# EAGLE design rx (EAGLE 9.1.3)
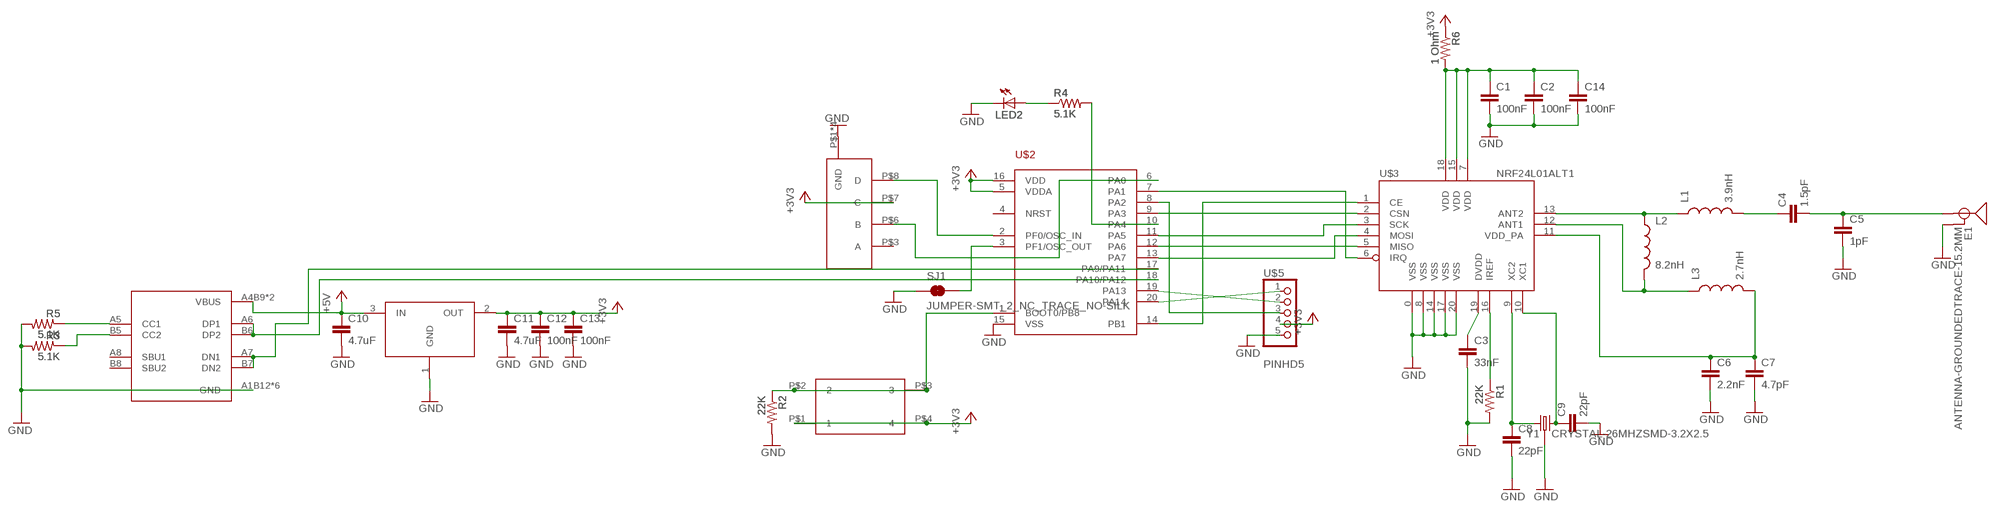
[diagram p0: schematic, sheet 1]

## Parts
C1  100nF  CAP0805  [0805]
C2  100nF  CAP0805  [0805]
C3  33nF  CAP0805  [0805]
C4  1.5pF  CAP0805  [0805]
C5  1pF  CAP0805  [0805]
C6  2.2nF  CAP0805  [0805]
C7  4.7pF  CAP0805  [0805]
C8  22pF  CAP0805  [0805]
C9  22pF  CAP0805  [0805]
C10  4.7uF  CAP0805  [0805]
C11  4.7uF  CAP0805  [0805]
C12  100nF  CAP0805  [0805]
C13  100nF  CAP0805  [0805]
C14  100nF  CAP0805  [0805]
E1  ANTENNA-GROUNDEDTRACE-15.2MM  [TRACE_ANTENNA_2.4GHZ_15.2MM]
L1  3.9nH  INDUCTOR0805  [0805]
L2  8.2nH  INDUCTOR0805  [0805]
L3  2.7nH  INDUCTOR0805  [0805]
LED2  LEDCHIP-LED0805  [CHIP-LED0805]
R1  22K  RESISTOR0805-RES  [0805]
R2  22K  RESISTOR0805-RES  [0805]
R3  5.1K  RESISTOR0805-RES  [0805]
R4  5.1K  RESISTOR0805-RES  [0805]
R5  5.1K  RESISTOR0805-RES  [0805]
R6  1 Ohm  RESISTOR0805-RES  [0805]
SJ1  JUMPER-SMT_2_NC_TRACE_NO-SILK  [SMT-JUMPER_2_NC_TRACE_NO-SILK]
U$1  SW_3POS_DEVSW_3POS_OFFICIAL  [SW_3POS_FOOT_OFFICIAL]
U$2  STM32F042F4  [TSSOP20]
U$3  NRF24L01ALT1  [QFN20_ALT1]
U$4  XC6206_DEV  [SOT23R_INFINEON]
U$5  PINHD5  [1X05]
U$6  USBC_16P  [USBC_16P_FOOT]
U$10  324_SW324_SWITCH_FOOT_HOLE  [342_SWICH_FOOT_HOLE]
Y1  CRYSTAL-26MHZSMD-3.2X2.5  [CRYSTAL-SMD-3.2X2.5MM]

## Nets
+3V3: C11.1 C12.1 C13.1 R6.1 U$1.P$7(C) U$2.5(VDDA) U$2.16(VDD) U$4.2(OUT) U$5.4 U$10.P$1 U$10.P$4
+5V: C10.1 U$4.3(IN) U$6.A4B9(VBUS) U$6.B4A9(VBUS)
GND: C1.2 C2.2 C3.2 C5.2 C6.2 C7.2 C8.2 C9.2 C10.2 C11.2 C12.2 C13.2 C14.2 E1.GND LED2.C R1.2 R2.2 R3.2 R5.2 SJ1.1 U$1.P$1(GND) U$1.P$2(GND) U$1.P$4(GND) U$1.P$5(GND) U$2.15(VSS) U$3.0(VSS) U$3.8(VSS) U$3.14(VSS) U$3.17(VSS) U$3.20(VSS) U$4.1(GND) U$5.5 U$6.A1B12(GND) U$6.B11A12(GND) U$6.P$13(GND) U$6.P$14(GND) U$6.P$15(GND) U$6.P$16(GND) Y1.2 Y1.4
N$1: C3.1 U$3.19(DVDD)
N$2: R1.1 U$3.16(IREF)
N$3: L1.1 L2.1 U$3.13(ANT2)
N$4: C4.1 L1.2
N$5: C4.2 C5.1 E1.ANT(SIGNAL)
N$6: L2.2 L3.1 U$3.12(ANT1)
N$7: C8.1 U$3.9(XC2) Y1.1
N$8: C6.1 C7.1 L3.2 U$3.11(VDD_PA)
N$9: C9.1 U$3.10(XC1) Y1.3
N$10: U$1.P$8(D) U$2.2(PF0/OSC_IN)
N$11: R2.1 U$2.1(BOOT0/PB8) U$10.P$2 U$10.P$3
N$12: U$2.17(PA9/PA11) U$6.A7(DN1) U$6.B7(DN2)
N$13: U$2.18(PA10/PA12) U$6.A6(DP1) U$6.B6(DP2)
N$14: U$2.12(PA6) U$3.5(MISO)
N$15: U$2.13(PA7) U$3.4(MOSI)
N$16: U$2.11(PA5) U$3.3(SCK)
N$17: U$2.19(PA13) U$5.2
N$18: LED2.A R4.1
N$19: SJ1.2 U$2.3(PF1/OSC_OUT)
N$20: U$2.20(PA14) U$5.1
N$21: U$2.8(PA2) U$5.3
N$22: U$2.14(PB1) U$3.1(CE)
N$23: R4.2 U$2.10(PA4)
N$24: U$2.9(PA3) U$3.2(CSN)
N$25: R3.1 U$6.B5(CC2)
N$26: U$1.P$6(B) U$2.6(PA0)
N$27: R5.1 U$6.A5(CC1)
N$28: C1.1 C2.1 C14.1 R6.2 U$3.7(VDD) U$3.15(VDD) U$3.18(VDD)
N$30: U$2.7(PA1) U$3.6(IRQ)
Unconnected: U$1.P$3(A) U$2.4(NRST) U$6.A8(SBU1) U$6.B8(SBU2)

## Library data of the parts
C1-C14 = clock:CAP: Capacitor Standard 0603 ceramic capacitor, and 0.1" leaded capacitor.
E1 = SparkFun-RF:ANTENNA-GROUNDED: Antenna w/ Ground Connection 2.4GHz antennae with signal and ground terminals. TRACE_ANTENNA_2.4GHZ_15.2MM - Meander Trace antenna 15.2 x 5.7mm footprint Based on layout from TI app note AN043 <http://www.ti.com/lit/an/swra117d/swra117d.pdf>. TRACE_ANTENNA_2.4GHZ_25.7MM - Inverted F trace antenna 25.7 x 7.5 mm footprint. Based on layout from TI design note DN0007 <http://www.ti.com/lit/an/swru120b/swru120b.pdf>.
L1-L3 = basicBoard:INDUCTOR: Inductors Basic Inductor/Choke - 0603 and 1206. Footprints are not proven and vary greatly between part numbers. INDUCTOR POWER 3.3UH 4.0A SMD 0.197" L x 0.197" W x 0.177" H (5.00mm x 5.00mm x 4.50mm)
LED2 = joyAnalog:LED: LED OSRAM: - CHIPLED LG R971, LG N971, LY N971, LG Q971, LY Q971, LO R971, LY R971 LH N974, LH R974 LS Q976, LO Q976, LY Q976 LO Q996 - Hyper CHIPLED LW Q18S LB Q993, LB Q99A, LB R99A - SideLED LS A670, LO A670, LY A670, LG A670, LP A670 LB A673, LV A673, LT A673, LW A673 LH A674 LY A675 LS A676, LA A676, LO A676, LY A676, LW A676 LS A679, LY A679, LG A679 - Hyper Micro SIDELED® LS Y876, LA Y876, LO Y876, LY Y876 LT Y87S - SmartLED LW L88C, LW L88S LB L89C, LB L89S, LG L890 LS L89K, LO L89K, LY L89K LS L896, LA L896, LO L896, LY L896 - TOPLED LS T670, LO T670, LY T670, LG T670, LP T670 LSG T670, LSP T670, LSY T670, LOP T670, LYG T670 LG T671, LOG T671, LSG T671 LB T673, LV T673, LT T673, LW T673 LH T674 LS T676, LA T676, LO T676, LY T676, LB T676, LH T676, LSB T676, LW T676 LB T67C, LV T67C, LT T67C, LS T67K, LO T67K, LY T67K, LW E67C LS E67B, LA E67B, LO E67B, LY E67B, LB E67C, LV E67C, LT E67C LW T67C LS T679, LY T679, LG T679 LS T770, LO T770, LY T770, LG T770, LP T770 LB T773, LV T773, LT T773, LW T773 LH T774 LS E675, LA E675, LY E675, LS T675 LS T776, LA T776, LO T776, LY T776, LB T776 LHGB T686 LT T68C, LB T68C - Hyper Mini TOPLED® LB M676 - Mini TOPLED Santana® LG M470 LS M47K, LO M47K, LY M47K Source: http://www.osram.convergy.de/
R1-R6 = joyAnalog:RESISTOR: Resistor Basic schematic elements and footprints for 0603, 1206, and PTH resistors.
SJ1 = SparkFun-Jumpers:JUMPER-SMT_2_NC_TRACE: Normally closed trace jumper This jumper has a trace between two pads so it's normally closed (NC). Use a razor knife to open the connection. For best results follow the IPC guidelines for cutting traces: Cutout at least 0.063 mm (0.005 in). Remove all loose material to clean up the cut area. Seal the cut with an approved epoxy. Reapply solder to reclose the connection.
U$1 = 3pos_slide_switch:SW_3POS_DEV
U$2 = tx:STM32F042F4
U$3 = nRF24L01-Chip-v13:NRF24L01: 2.4GHz Low Power Transceiver This is the very popular, low cost, very low power RF transceiver from Nordic Semiconductor. Simple SPI interface. SKU: COM-00690
U$4 = 3pos_slide_switch:XC6206_DEV
U$5 = adafruit_changed:PINHD5
U$6 = my_usbc_16p:USBC_16P
U$10 = 3pos_slide_switch:324_SW
Y1 = SparkFun-Clocks:CRYSTAL-26MHZ: 26MHz Crystal w/ Ground Pin Digikey Example <http://www.digikey.com/product-detail/en/epson/TSX-3225%2026.0000MF09Z-AC3/SER3627CT-ND/1802878> Frequency: 26MHz Frequency Stability: ±9ppm Frequency Tolerance: ±10ppm Load Capacitance: 9pF SparkFun Products: SparkFun ESP32 Thing <https://www.sparkfun.com/products/13907> SparkFun ESP8266 Thing Dev Board <https://www.sparkfun.com/products/13711>; PROD_ID: XTAL-12454

## Board
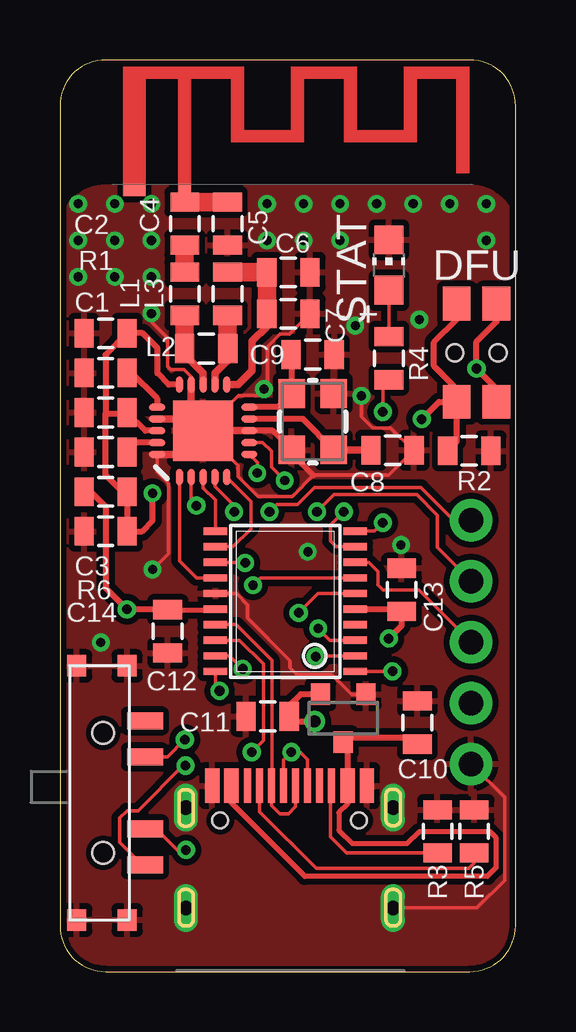
[diagram p1: board, top side]
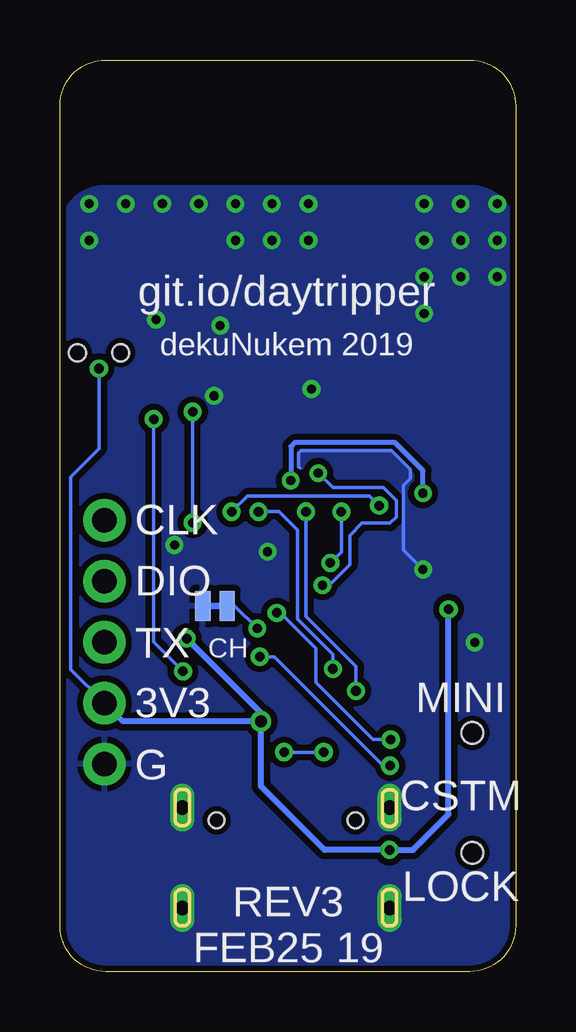
[diagram p2: board, bottom side, seen from below]

Size 19 x 38 mm. Coordinates in mm from the lower left corner, seen from the top.
Outline: 0,36.09 0,1.91 arc90 1.91,0 17.09,0 arc90 19,1.91 19,36.09 arc90 17.09,38 1.91,38 arc90 0,36.09
Copper layers (1*16): Top 0.035mm / dielectric 1.5mm / Bottom 0.035mm
Design rules "SparkFun-2-layer-TIGHT *": minimum track width 6mil, minimum drill 15mil, track to track 6mil, track to pad 6mil, pad to pad 6mil, via to via 6mil, smd to smd 6mil, copper to edge 8mil, drill to drill 6mil, minimum pad ring 7mil, minimum via ring 7mil, stop-mask expansion 4mil, vias tented up to drill 25mil, thermal gap 10mil

### Footprints (pad centres in the part's own frame; a part is rotated, then mirrored left to right if it is on the bottom)
0805 = smd 0.8 x 1.2: 1 -0.9,0; 2 0.9,0
TRACE_ANTENNA_2.4GHZ_15.2MM = smd 0.5 x 0.5: ANT 0,-0.25 | smd 0.9 x 0.5: GND -2.1,-0.25
CHIP-LED0805 = smd 1.2 x 1.2: A 0,-1.05; C 0,1.05
SMT-JUMPER_2_NC_TRACE_NO-SILK = smd 0.635 x 1.27: 1 -0.508,0; 2 0.508,0
SW_3POS_FOOT_OFFICIAL = smd 0.9 x 0.8: P$1 0,0; P$2 0,2.1; P$4 10.6,2.1; P$5 10.6,0 | smd 0.7 x 1.5: P$3 2.3,2.85; P$6 3.8,2.85; P$7 6.8,2.85; P$8 8.3,2.85 | hole 0.9: 2.8,1.1; 7.8,1.1
TSSOP20 = smd 0.305 x 0.991: 1 -2.925,-2.918; 2 -2.275,-2.918; 3 -1.625,-2.918; 4 -0.975,-2.918; 5 -0.325,-2.918; 6 0.325,-2.918; 7 0.975,-2.918; 8 1.625,-2.918; 9 2.275,-2.918; 10 2.925,-2.918; 11 2.925,2.918; 12 2.275,2.918; 13 1.625,2.918; 14 0.975,2.918; 15 0.325,2.918; 16 -0.325,2.918; 17 -0.975,2.918; 18 -1.625,2.918; 19 -2.275,2.918; 20 -2.925,2.918
QFN20_ALT1 = smd 2.515 x 2.515: 0 0,0 | smd 0.686 x 0.293: 1 -1.925,0.986; 2 -1.925,0.493; 3 -1.925,0; 4 -1.925,-0.493; 5 -1.925,-0.986; 11 1.925,-0.986; 12 1.925,-0.493; 13 1.925,0; 14 1.925,0.493; 15 1.925,0.986 | smd 0.293 x 0.686: 6 -0.986,-1.925; 7 -0.493,-1.925; 8 0,-1.925; 9 0.493,-1.925; 10 0.986,-1.925; 16 0.986,1.925; 17 0.493,1.925; 18 0,1.925; 19 -0.493,1.925; 20 -0.986,1.925
SOT23R_INFINEON = smd 0.8 x 0.9: 1 -0.95,-1; 2 0.95,-1; 3 0,1
1X05 = drill 1.016 pad 1.778: 1 -6.35,0; 2 -3.81,0; 3 -1.27,0; 4 1.27,0; 5 3.81,0
USBC_16P_FOOT = smd 0.6 x 1.45: A1B12 0,0; A4B9 0.8,0; B4A9 5.65,0; B11A12 6.45,0 | smd 0.3 x 1.45: A5 1.975,0; A6 2.975,0; A7 3.475,0; A8 4.475,0; B5 4.975,0; B6 3.975,0; B7 2.475,0; B8 1.475,0 | drill 0.6 pad 1 long: P$13 -1.095,-0.915; P$14 7.545,-0.915; P$15 -1.095,-5.095; P$16 7.545,-5.095 | hole 0.65: 0.335,-1.445; 6.115,-1.445
342_SWICH_FOOT_HOLE = smd 1.4 x 1.15: P$1 -2.05,-0.825; P$2 -2.05,0.825; P$3 2.05,0.825; P$4 2.05,-0.825 | hole 0.7: 0,0.9; 0,-0.9
CRYSTAL-SMD-3.2X2.5MM = smd 1.2 x 1.1: 1 -1.175,-0.875; 2 1.175,-0.875; 3 1.175,0.875; 4 -1.175,0.875

### Placement (x,y rotation side)
C1  1.91,23.3 180 top
C2  1.91,26.61 180 top
C3  1.91,21.65 180 top
C4  5.21,31.18 90 top
C5  6.99,31.18 270 top
C6  9.53,29.15 0 top
C7  9.53,27.42 0 top
C8  13.87,21.73 0 top
C9  10.54,25.72 0 top
C10  14.91,10.38 90 top
C11  8.66,10.63 180 top
C12  4.5,14.18 270 top
C13  14.25,15.92 90 top
C14  1.91,18.35 180 top
E1  5.21,32.82 0 top
L1  5.21,28.26 90 top
L2  6.1,25.97 0 top
L3  6.99,28.26 90 top
LED2  13.72,29.45 0 top
R1  1.91,24.96 180 top
R2  17.07,21.7 0 top
R3  15.75,5.84 90 top
R4  13.72,25.57 270 top
R5  17.27,5.84 90 top
R6  1.91,20 0 top
SJ1  12.54,15.24 0 bottom
U$1  0.7,12.75 270 top
U$2  9.4,15.43 90 top
U$3  5.97,22.54 90 top
U$4  11.81,10.56 180 top
U$5  17.14,12.46 270 top
U$6  6.35,7.75 0 top
U$10  17.37,25.79 90 top
Y1  10.54,22.92 90 top

### Tracks (layer width: path | path; a pad name or v marks a point on that pad's centre or on a via)
+3V3  (via drill 0.4, 0.5)
  Top 0.152: v5.26,5.07 4.89,5.07 4.01,5.95 U$1.P$7
  Top 0.203: 4.48,15.1 C12.1 6.45,15.08 U$2.16
  Top 0.254: U$2.5 14.16,15.11 C13.1 14.25,14.41 v13.72,13.88 | U$4.2 10.03,11.56 9.56,11.09 C11.1 9.77,10.43 v10.62,10.43 | U$10.P$1 18.2,24.31 v17.37,25.13 17.37,26.26 18.2,27.09 U$10.P$4 | R6.1 1.28,20 1.91,19.38 1.91,15.99 v2.79,15.1 4.48,15.1
  Bottom 0.152: U$5.4 18.54,12.59 18.54,20.62 17.37,21.79 v17.37,25.13
  Bottom 0.254: v10.62,10.43 10.62,7.72 7.96,5.07 v5.26,5.07 4.28,5.07 2.79,6.55 v2.79,15.1 | v10.62,10.43 16.38,10.43 U$5.4 | v13.72,13.88 10.62,10.78 v10.62,10.43
+5V
  Top 0.203: U$6.B4A9 12,7 11.63,6.63 11.63,5.89 12.19,5.33 14.48,5.33 14.99,5.84 17.93,5.84 18.19,5.59 18.19,4.32 17.83,3.96 10.21,3.96 7.15,7.02 U$6.A4B9
  Top 0.254: C10.1 14.63,9.75 12.01,9.75 U$4.3 12,9.37 U$6.B4A9
GND  (via drill 0.38)
  Top 0.152: 9.67,21.59 Y1.4 | U$4.1 12.17,11.56 11.33,12.39 9.86,12.39 9.6,12.65 9.6,12.95 7.82,14.73 7.82,15.29 7.36,15.76 U$2.15 | 5.97,22.3 6.22,22.3 7.43,21.09 7.43,20.64 8.26,19.81 9.69,19.81 10.57,20.69 13.73,20.69 C8.2 14.72,21.73 13.79,22.66 13.06,22.66 12.57,23.14 v12.57,24 | U$5.5 18.54,7.25 18.54,3.81 17.38,2.65 U$6.P$16 | U$3.14 5.48,24.8 5.18,25.09 4.62,25.09 4.5,25.22 4.5,26.42 3.81,27.1 v3.81,27.43 | 6.78,22.54 6.81,22.57 6.81,23.37 7.44,24 8.23,24 v8.51,24.28 8.66,24.43 8.66,26.06 9.17,26.57 9.58,26.57 C7.2 | U$3.20 4.04,20.83 4.53,20.34 4.53,17.44 v3.86,16.76
  Top 0.254: Y1.4 8.87,22.54 8.56,22.54 U$3.8 | 10.57,20.69 9.67,21.59
  Top 0.305: U$3.8 7.37,22.54 6.78,22.54 U$3.0 | U$3.0 5.48,22.54 5.48,23.05 | 5.48,23.05 U$3.14 | U$3.17 5.48,23.04 5.48,23.05 | U$3.20 5.97,21.56 5.97,22.3 U$3.0
  Bottom 0.152: v3.86,16.76 4.67,17.58 4.67,19.81 4.67,20.27 4.39,20.55 4.39,20.93 5.18,21.72 8.94,21.72 9.04,21.61 9.04,21.03 8.99,20.98
  other vias: 0.76,32 2.29,32 0.76,30.48 2.29,30.48 0.76,28.96 3.81,32 3.81,30.48 2.29,28.96 3.81,28.96 8.64,32 8.64,30.48 10.16,32 10.16,30.48 11.68,32 13.21,32 14.73,32 14.99,27.18 16.26,32 17.78,32 11.68,30.48 17.78,30.48 1.7,13.72 14.22,17.78 12.32,26.92 10.34,17.5
  pour Top (isolate 0.254): 1.91,0 17.09,0 arc90 19,1.91 19,30.84 arc90 17.09,32.75 1.91,32.75 arc90 0,30.84 0,1.91 arc90
  pour Bottom (isolate 0.254): 0,30.84 0,1.91 arc90 1.91,0 17.09,0 arc90 19,1.91 19,30.84 arc90 17.09,32.75 1.91,32.75 arc90
N$1
  Top 0.254: U$3.19 3.2,22.05 C3.1
N$2
  Top 0.254: R1.1 2.98,24.96 4.04,23.9 U$3.16
N$3
  Top 0.305: U$3.13 5.97,24.96 5.2,25.73 L2.1 5.21,25.98
  Top 0.762: 5.21,25.98 L1.1
N$4
  Top 0.762: L1.2 C4.1
N$5
  Top 0.254: C4.2 E1.ANT
  Top 0.762: C5.1 C4.2
N$6
  Top 0.305: U$3.12 6.46,24.94 7,25.48 L2.2 6.99,25.98
  Top 0.762: 6.99,25.98 L3.1
N$7
  Top 0.254: U$3.9 10.13,23.04 Y1.1 11.45,21.78
  Top 0.305: C8.1 11.5,21.73 11.45,21.78
N$8
  Top 0.305: C6.1 | U$3.11 7.42,24.47 8.02,25.06 8.02,26.28 8.62,26.89 C7.1
  Top 0.762: C6.1 L3.2 | C6.1 8.62,28.19 C7.1
N$9
  Top 0.254: U$3.10 9.1,23.53 Y1.3 9.67,25.69 C9.1
N$10  (via drill 0.4)
  Top 0.152: v10.67,13.12 10.7,13.16 U$2.2 | v5.23,8.59 5.13,8.59 3.25,6.71 2.79,6.71 2.49,6.4 2.49,5.38 3.43,4.45 U$1.P$8
  Bottom 0.152: v10.67,13.12 10.06,13.12 5.52,8.59 v5.23,8.59
N$11  (via drill 0.4)
  Top 0.152: U$2.1 v13.86,12.51 v13.87,12.51
  Top 0.254: U$10.P$3 16.55,27.18 15.6,26.23 15.6,25.23 16.4,24.43 16.4,23.9 U$10.P$2 | v15.09,23.03 15.8,23.74 U$10.P$2 | R2.1 16.55,22.09 U$10.P$2
  Bottom 0.152: v13.87,12.51 15.09,13.73 v15.09,23.03
N$12
  Top 0.152: U$2.17 7.35,14.46 8.84,12.97 8.84,7.76 U$6.B7 8.82,6.92 9.17,6.58 9.53,6.58 9.82,6.88 U$6.A7
N$13  (via drill 0.4)
  Top 0.152: U$2.18 7.49,13.81 8.48,12.82 8.48,9.63 v8,9.14 | U$6.B6 10.32,8.85 10.03,9.14 v9.65,9.14 9.32,8.82 U$6.A6
  Bottom 0.152: v8,9.14 v9.65,9.14
N$14
  Top 0.152: U$3.5 7.98,19.6 7.98,18.46 7.23,17.71 U$2.12
N$15  (via drill 0.4)
  Top 0.152: U$2.13 7.7,17.06 v7.72,17.03 | U$3.4 6.46,20.22 7.26,19.42 v7.26,19.17
  Bottom 0.152: v7.26,19.17 7.26,17.49 v7.72,17.03
N$16
  Top 0.152: U$3.3 5.97,20.16 6.48,19.65 U$2.11
N$17  (via drill 0.4)
  Top 0.152: U$2.19 7.08,13.16 v7.62,12.61 | v10.72,19.17 11.43,19.88 14.88,19.88 15.75,19.02 15.75,17.67 U$5.2
  Bottom 0.152: v7.62,12.61 7.62,13.22 9.09,14.7 9.09,18.41 9.86,19.17 v10.72,19.17
N$18
  Top 0.152: LED2.A R4.1
N$19  (via drill 0.38)
  Top 0.152: U$2.3 11.26,13.81 v10.77,14.3
  Bottom 0.152: SJ1.2 11.71,15.24 v10.77,14.3
N$20  (via drill 0.4)
  Top 0.152: U$2.20 6.48,11.88 v6.66,11.7 | v8.74,19.17 9.04,19.47 9.91,19.47 10.62,20.18 15.06,20.18 16.43,18.81 U$5.1
  Bottom 0.152: v6.66,11.7 6.66,12.72 8.74,14.8 v8.74,19.17
N$21
  Top 0.152: U$2.8 12.88,17.06 13.26,16.68 13.26,16.12 13.46,15.92 14.96,15.92 U$5.3
N$22
  Top 0.152: U$2.14 5.69,16.41 4.98,17.11 U$3.1
N$23  (via drill 0.4)
  Top 0.152: v13.46,23.33 13.46,24.41 R4.2 | U$2.10 13.11,18.36 v13.46,18.71
  Bottom 0.152: v13.46,18.71 v13.46,23.33
N$24  (via drill 0.4)
  Top 0.152: v11.84,19.17 11.28,18.61 11.28,17.95 11.52,17.71 U$2.9 | U$3.2 5.48,19.64 v5.69,19.42
  Bottom 0.152: v5.69,19.42 6.1,19.83 11.18,19.83 v11.84,19.17
N$25
  Top 0.152: R3.1 11.95,4.94 11.27,5.62 11.27,7.7 U$6.B5
N$26  (via drill 0.4)
  Top 0.152: v9.96,14.95 10.76,15.76 U$2.6 | U$1.P$6 4.49,8.95 v5.21,9.67
  Bottom 0.152: v9.96,14.95 9.8,14.95 8.33,13.48 8.33,12.06 5.94,9.67 v5.21,9.67
N$27
  Top 0.152: R5.1 17.27,4.52 17.04,4.29 10.69,4.29 8.32,6.66 U$6.A5
N$28  (via drill 0.38)
  Top 0.152: U$3.7 8.46,22.05 8.81,21.69 8.81,21.03 v9.37,20.47
  Top 0.254: U$3.18 3.57,22.54 C1.1 2.77,23.27 1.91,23.27 | U$3.15 4.54,24.47 4.06,24.94 4.06,25.98 3.44,26.61 C2.1 1.91,25.71 1.91,23.27 | 1.91,23.27 1.91,20.7 2.6,20 R6.2 C14.1 3.42,18.35 3.86,18.8 v3.86,19.94
  Bottom 0.203: v3.86,19.94 3.86,20.88 5.03,22.05 9.22,22.05 9.37,21.89 v9.37,20.47
N$30  (via drill 0.38)
  Top 0.152: U$3.6 8.23,21.22 v8.23,20.78 | v8.05,16.1 8.36,16.41 U$2.7
  Bottom 0.152: v8.23,20.78 7.62,20.17 5.51,20.17 4.98,19.63 4.98,18.95 5.23,18.69 6.4,18.69 6.91,18.19 6.91,16.97 7.77,16.1 v8.05,16.1

### Text on the board
tNames: STAT | DFU
bNames: git.io/daytripper | dekuNukem 2019 | CLK | DIO | CH | TX | MINI | 3V3 | G | CSTM | LOCK | REV3 / FEB25 19